# Altium project STM32H7_Expand.PrjPcb
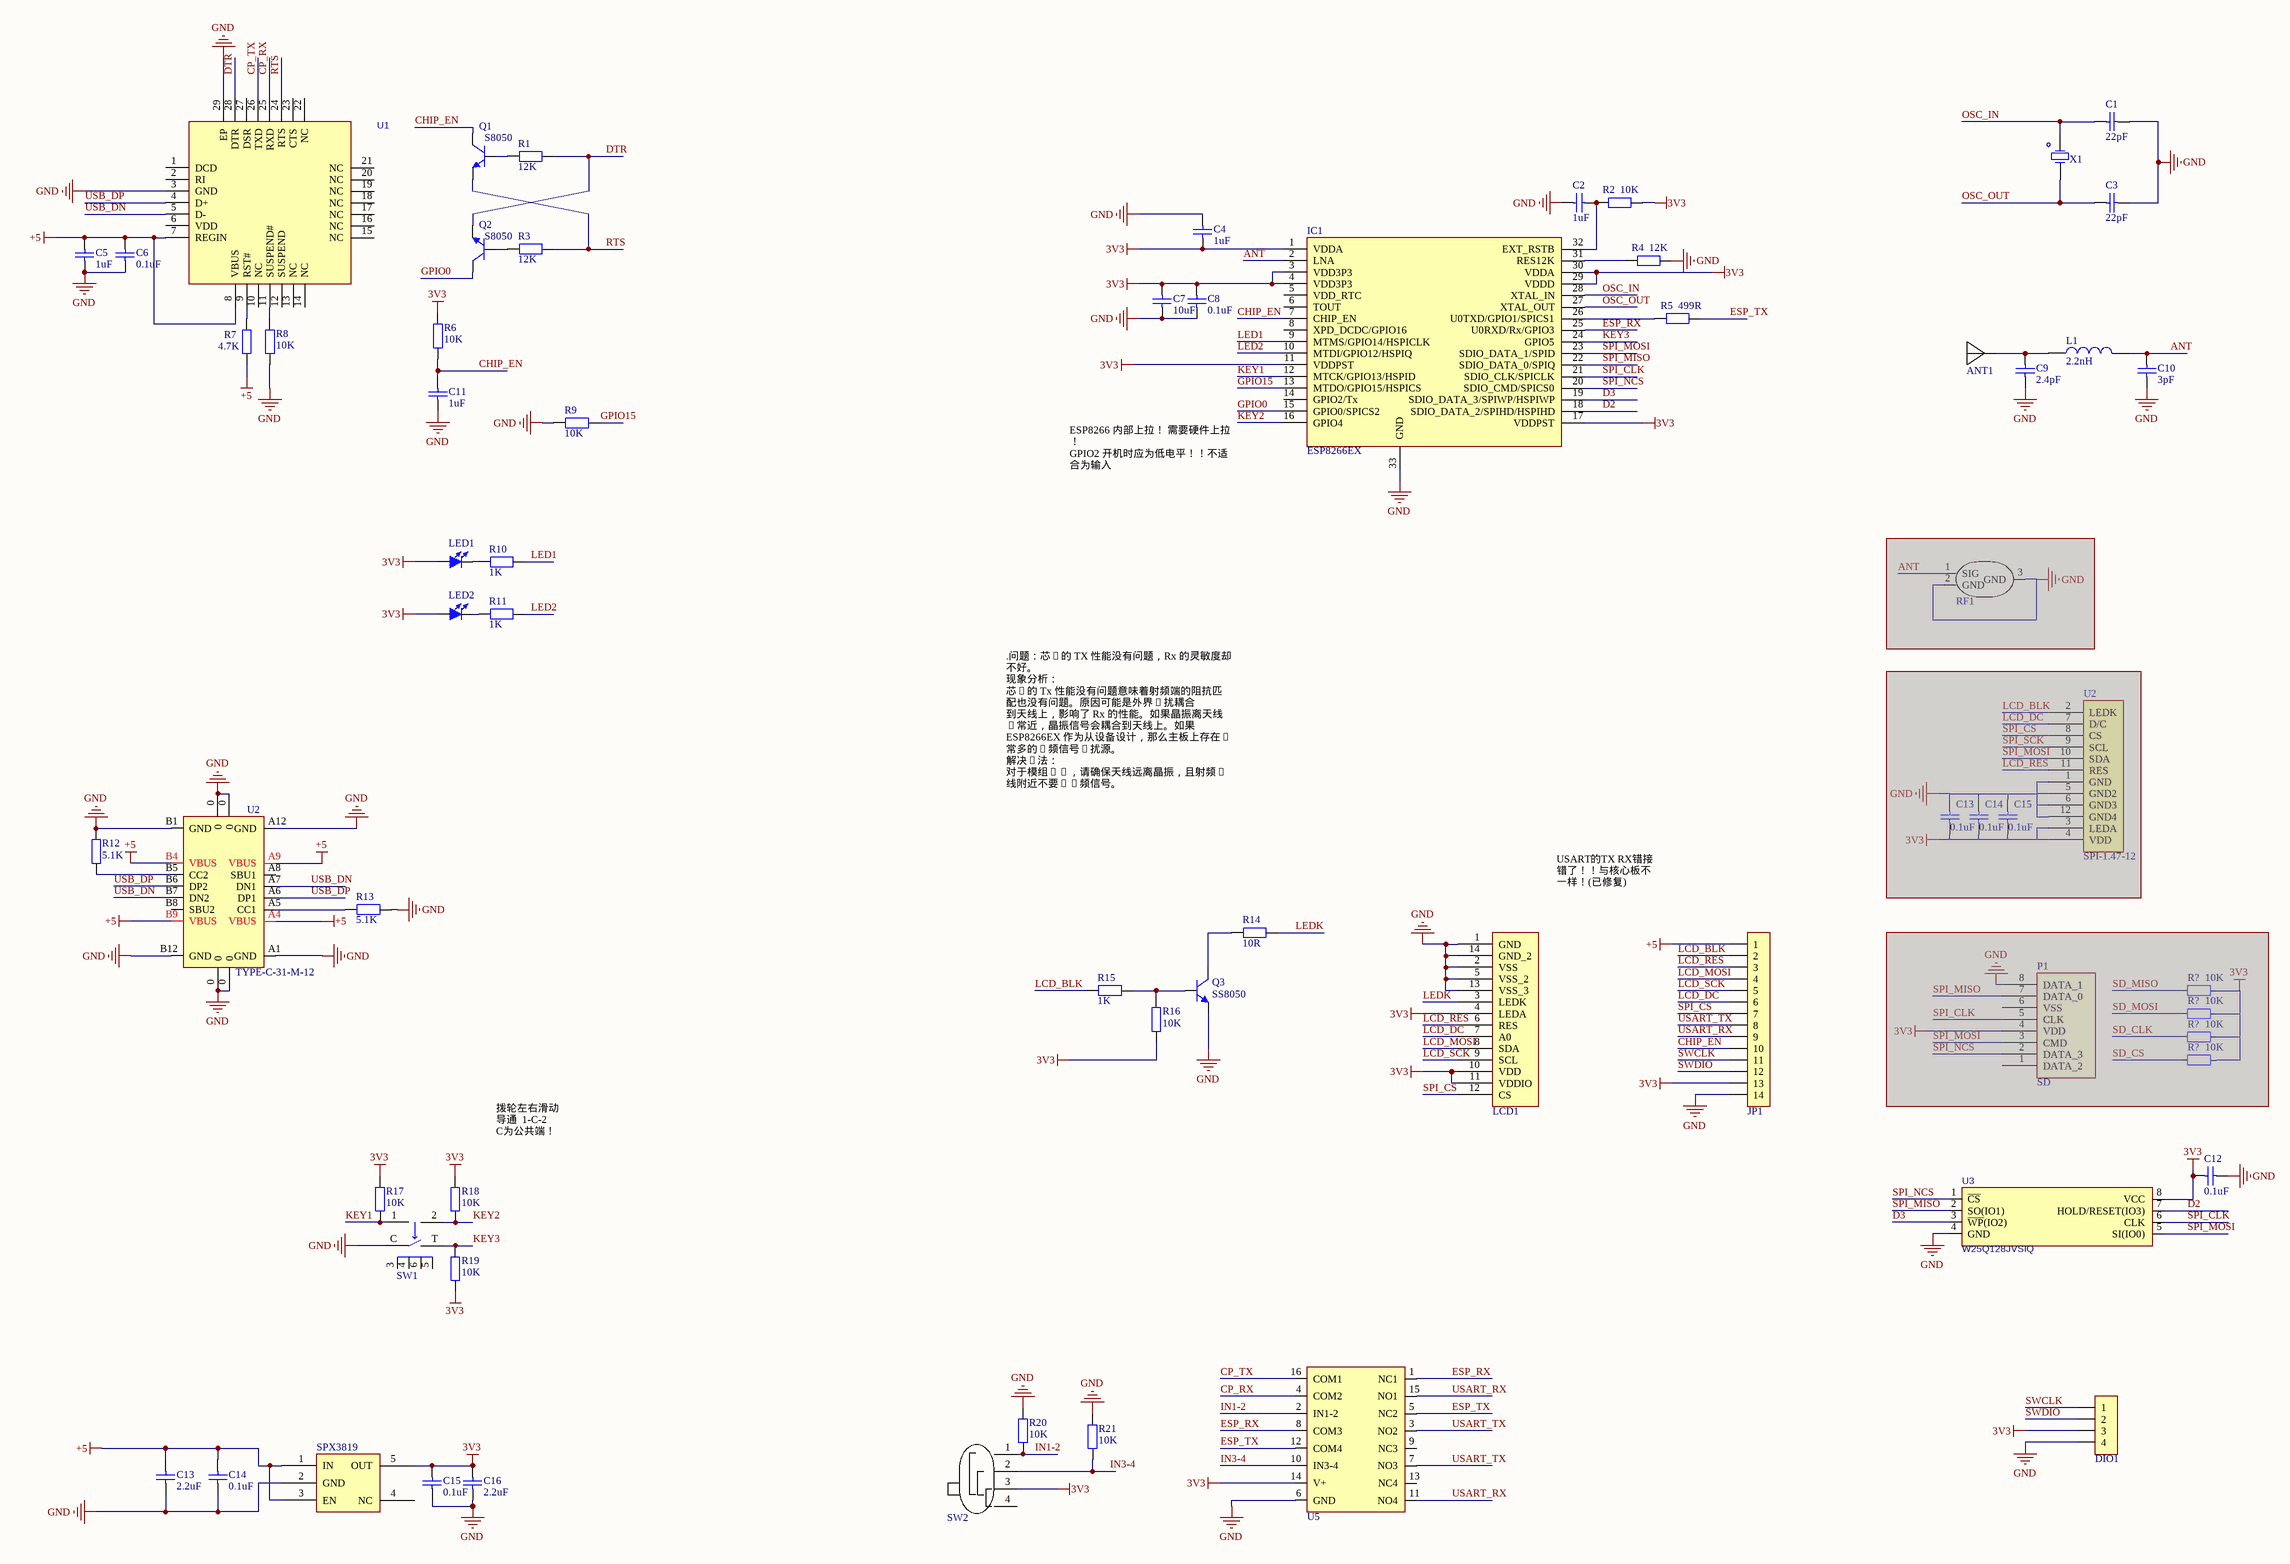
[diagram p0: STM32H7_Expand.SchDoc]
1 sheet, 66 parts. Net scope: global (net labels, ports and power ports of the same name join across sheets).
Board file: STM32H7_Expand.PcbDoc

## Sheet STM32H7_Expand.SchDoc
size A2; SheetNumber: 1; SheetTotal: 1

### Parts
(Parts that share a designator on the sheet are numbered #1, #2 ... from top to bottom, then left to right.)
ANT1  AN9520-245  [AN9520-245]  (value not drawn)
C1  22pF  [C0603_L]
C2  1uF  [C0603_L]
C3  22pF  [C0603_L]
C4  1uF  [C0603_L]
C5  1uF  [C0603_L]
C6  0.1uF  [C0603_L]
C7  10uF  [C0603_L]
C8  0.1uF  [C0603_L]
C9  2.4pF  [C0402_L]
C10  3pF  [C0402_L]
C11  1uF  [C0603_L]
C12  0.1uF  [C0603_L]
C13#1  0.1uF  [C0603_L]  (masked out: inside a compile mask, not in the netlist)
C13#2  2.2uF  [C0603_L]
C14#1  0.1uF  [C0603_L]  (masked out: inside a compile mask, not in the netlist)
C14#2  0.1uF  [C0603_L]
C15#1  0.1uF  [C0603_L]  (masked out: inside a compile mask, not in the netlist)
C15#2  0.1uF  [C0603_L]
C16  2.2uF  [C0603_L]
DIO1  HDR-1X4  [MX 1.25-WS-4P]  (value not drawn)
IC1  ESP8266EX  [QFN32 5x5_L]
JP1  FH34SRJ-14S-0.5SH(50)  [FH34SRJ-14S-0.5SH(50)]  (value not drawn)
L1  2.2nH  [L0402]
LCD1  SPI144-14  [FPC-0.8-14P]  (value not drawn)
LED1  (no value)  [LED0603_R]
LED2  (no value)  [LED0603_B]
P1  SD  [TF-01A]  (masked out: inside a compile mask, not in the netlist)
Q1  S8050  [SOT23-3N]
Q2  S8050  [SOT23-3N]
Q3  SS8050  [SOT23-3N]
R1  12K  [R0603_L]
R2  10K  [R0603_L]
R3  12K  [R0603_L]
R4  12K  [R0603_L]
R5  499R  [R0603_L]
R6  10K  [R0603_L]
R7  4.7K  [R0603_L]
R8  10K  [R0603_L]
R9  10K  [R0603_L]
R10  1K  [R0603_L]
R11  1K  [R0603_L]
R12  5.1K  [R0603_L]
R13  5.1K  [R0603_L]
R14  10R  [R0603_L]
R15  1K  [R0603_L]
R16  10K  [R0603_L]
R17  10K  [R0603_L]
R18  10K  [R0603_L]
R19  10K  [R0603_L]
R20  10K  [R0603_L]
R21  10K  [R0603_L]
R?#1  10K  [RES_0402]  (masked out: inside a compile mask, not in the netlist)
R?#2  10K  [RES_0402]  (masked out: inside a compile mask, not in the netlist)
R?#3  10K  [RES_0402]  (masked out: inside a compile mask, not in the netlist)
R?#4  10K  [RES_0402]  (masked out: inside a compile mask, not in the netlist)
RF1  BWIPX-1-001E  [IPEX-SMD_BWIPX-1-001E]  (value not drawn)  (masked out: inside a compile mask, not in the netlist)
SW1  TM-2023  [SW-SMD_TM-2023-1]  (value not drawn)
SW2  MSK13C02  [SW-SMD_MSK13C02-SZ]  (value not drawn)
U1  CP2102-GMR  [QFN28 5x5]  (value not drawn)
U2#1  SPI-1.47-12  [FPC-0.7-12P]  (masked out: inside a compile mask, not in the netlist)
U2#2  TYPE-C-31-M-12  [TYPE-C-31-M-12]
U3  W25Q128JVSIQ  [SOIC-8W]
U4  SPX3819  [SOT23-5L]
U5  RS2299XTQC16  [QFN16 3x3_L]  (value not drawn)
X1  NX1612SA-26MHZ-STD-CIS-1  [OSC-SMD_4P-L1.6-W1.2-BL]  (value not drawn)

### Nets
3V3: C4.1 C7.2 C8.2 C12.1 C15#2.2 C16.2 DIO1.3 IC1.1(VDDA) IC1.3(VDD3P3) IC1.4(VDD3P3) IC1.11(VDDPST) IC1.17(VDDPST) IC1.29(VDDD) IC1.30(VDDA) JP1.13 LCD1.4(LEDA) LCD1.10(VDD) LCD1.11(VDDIO) LED1.1(A) LED2.1(A) R2.2 R6.1 R16.1 R17.1 R18.1 R19.2 SW2.3 U3.8(VCC) U4.5(OUT) U5.14(V+)
+5: C5.2 C6.2 C13#2.2 C14#2.2 JP1.1 R7.2 U1.7(REGIN) U1.8(VBUS) U2#2.A4(VBUS) U2#2.A9(VBUS) U2#2.B4(VBUS) U2#2.B9(VBUS) U4.1(IN) U4.3(EN)
GND: C1.1 C2.2 C3.1 C4.2 C5.1 C6.1 C7.1 C8.1 C9.1 C10.1 C11.1 C12.2 C13#2.1 C14#2.1 C15#2.1 C16.1 DIO1.4 IC1.33(GND) JP1.14 LCD1.1(GND) LCD1.2(VSS) LCD1.5(VSS_2) LCD1.13(VSS_3) LCD1.14(GND_2) Q3.2(E) R4.2 R8.2 R9.1 R12.2 R13.1 R20.1 R21.1 SW1.C U1.3(GND) U1.29(EP) U2#2.0 U2#2.A1(GND) U2#2.A12(GND) U2#2.B1(GND) U2#2.B12(GND) U3.4(GND) U4.2(GND) U5.6(GND)
ANT: C10.2 IC1.2(LNA) L1.2
CHIP_EN: C11.2 IC1.7(CHIP_EN) JP1.10 Q1.3(C) R6.2
CP_RX: U1.25(RXD) U5.4(COM2)
CP_TX: U1.26(TXD) U5.16(COM1)
D2: IC1.18(SDIO_DATA_2/SPIHD/HSPIHD) U3.7(HOLD/RESET(IO3))
D3: IC1.19(SDIO_DATA_3/SPIWP/HSPIWP) U3.3(~{WP}(IO2))
DTR: Q2.2(E) R1.2 U1.28(DTR)
ESP_RX: IC1.25(U0RXD/Rx/GPIO3) U5.1(NC1) U5.8(COM3)
ESP_TX: R5.2 U5.5(NC2) U5.12(COM4)
GPIO0: IC1.15(GPIO0/SPICS2) Q2.3(C)
GPIO15: IC1.13(MTDO/GPIO15/HSPICS) R9.2
IN1-2: R20.2 SW2.1 U5.2(IN1-2)
IN3-4: R21.2 SW2.2 U5.10(IN3-4)
KEY1: IC1.12(MTCK/GPIO13/HSPID) R17.2 SW1.1
KEY2: IC1.16(GPIO4) R18.2 SW1.2
KEY3: IC1.24(GPIO5) R19.1 SW1.T
LCD_BLK: JP1.2 R15.1
LCD_DC: JP1.6 LCD1.7(A0)
LCD_MOSI: JP1.4 LCD1.8(SDA)
LCD_RES: JP1.3 LCD1.6(RES)
LCD_SCK: JP1.5 LCD1.9(SCL)
LED1: IC1.9(MTMS/GPIO14/HSPICLK) R10.2
LED2: IC1.10(MTDI/GPIO12/HSPIQ) R11.2
LEDK: LCD1.3(LEDK) R14.1
OSC_IN: C1.2 IC1.28(XTAL_IN) X1.1(IN)
OSC_OUT: C3.2 IC1.27(XTAL_OUT) X1.3(OUT)
RTS: Q1.2(E) R3.2 U1.24(RTS)
SPI_CLK: IC1.21(SDIO_CLK/SPICLK) U3.6(CLK)
SPI_CS: JP1.7 LCD1.12(CS)
SPI_MISO: IC1.22(SDIO_DATA_0/SPIQ) U3.2(SO(IO1))
SPI_MOSI: IC1.23(SDIO_DATA_1/SPID) U3.5(SI(IO0))
SPI_NCS: IC1.20(SDIO_CMD/SPICS0) U3.1(~{CS})
SWCLK: DIO1.1 JP1.11
SWDIO: DIO1.2 JP1.12
USART_RX: JP1.9 U5.11(NO4) U5.15(NO1)
USART_TX: JP1.8 U5.3(NO2) U5.7(NO3)
USB_DN: U1.5(D-) U2#2.A7(DN1) U2#2.B7(DN2)
USB_DP: U1.4(D+) U2#2.A6(DP1) U2#2.B6(DP2)
NetANT1_1: ANT1.1 C9.2 L1.1
NetC2_1: C2.1 IC1.32(EXT_RSTB) R2.1
NetIC1_26: IC1.26(U0TXD/GPIO1/SPICS1) R5.1
NetIC1_31: IC1.31(RES12K) R4.1
NetLED1_2: LED1.2(K) R10.1
NetLED2_2: LED2.2(K) R11.1
NetQ1_1: Q1.1(B) R1.1
NetQ2_1: Q2.1(B) R3.1
NetQ3_1: Q3.1(B) R15.2 R16.2
NetQ3_3: Q3.3(C) R14.2
NetR7_1: R7.1 U1.9(RST#)
NetR8_1: R8.1 U1.11(SUSPEND#)
NetR12_1: R12.1 U2#2.B5(CC2)
NetR13_2: R13.2 U2#2.A5(CC1)

Not connected (* = marked no-connect by the designer): IC1 5(VDD_RTC) 6(TOUT) 8(XPD_DCDC/GPIO16) 14(GPIO2/Tx); SW1 3 4 5 6; SW2 4; U1 1(DCD) 2(RI) 6(VDD) 10(NC) 12(SUSPEND) 13(NC) 14(NC) 15(NC) 16(NC) 17(NC) 18(NC) 19(NC) 20(NC) 21(NC) 22(NC) 23(CTS) 27(DSR); U2#2 A8(SBU1) B8(SBU2); U4 4(NC); U5 9(NC3) 13(NC4); X1 2(GND) 4(GND)

### Notes on the sheet
- ESP8266 内部上拉！ 需要硬件上拉！
  GPIO2 开机时应为低电平！！不适合为输入
- .问题：芯⽚的 TX 性能没有问题，Rx 的灵敏度却不好。
  现象分析：
  芯⽚的 Tx 性能没有问题意味着射频端的阻抗匹配也没有问题。原因可能是外界⼲扰耦合
  到天线上，影响了 Rx 的性能。如果晶振离天线⾮常近，晶振信号会耦合到天线上。如果
  ESP8266EX 作为从设备设计，那么主板上存在⾮常多的⾼频信号⼲扰源。
  解决⽅法：
  对于模组⽽⾔，请确保天线远离晶振，且射频⾛线附近不要⾛⾼频信号。
- USART的TX RX错接错了！！与核心板不一样！(已修复)
- (near R18) 拨轮左右滑动
  导通  1-C-2
  C为公共端！

### Library data of the parts
ANT1 = AN9520-245: 陶瓷天线; BOM名称: PCB板载天线; 联系卖家，免费技术支持: 唯一出售店铺网址https://shop463601444.taobao.com
C1-C12 C13#1 C13#2 C14#1 C14#2 C15#1 C15#2 C16 = C: 贴片电容; BOM名称: 无极性贴片电容; 联系卖家，免费查找封装: 唯一出售店铺网址https://shop463601444.taobao.com; 封装库来自淘宝卖家ID：黄晶宝石: 其他店铺购入均为盗版假冒封装库，请立即申请退款
DIO1 = Header 4: 4P接插件; 联系卖家，免费技术支持: 唯一出售店铺网址https://shop463601444.taobao.com; BOM名称: 4P接插件
IC1 = ESP8266EX: WIFI-芯片 / C77967
JP1 = FH34SRJ-14S-0.5SH(50): C324724
L1 = L: 贴片小功率电感; BOM名称: 小功率贴片电感; 联系卖家，免费查找封装: 唯一出售店铺网址https://shop463601444.taobao.com; 封装库来自淘宝卖家ID：黄晶宝石: 其他店铺购入均为盗版假冒封装库，请立即申请退款
LED1 LED2 = LED-SMD: 贴片LED; 封装库来自淘宝卖家 ID：黄晶宝石: 其他店铺购入均为假冒，请立即申请退款，本店奖励现金5~20元; BOM名称: 贴片LED
P1 = Micro SD_TF-01A: TF-01A / C91145; 联系卖家，免费查找封装: 唯一出售店铺网址https://shop463601444.taobao.com
Q1 Q2 = 8050-SMD: 高频放大-NPN型; 联系卖家，免费查找封装: 唯一出售店铺网址https://shop463601444.taobao.com; 封装库来自淘宝卖家 ID：黄晶宝石: 其他店铺购入均为盗版，不享受售后技术支持服务，请立即申请退款; 参数: 40V 1.5A 1W 100MHZ; BOM名称: 高频放大-NPN型
Q3 = 8050-SMD: C2150 / NPN; BOM名称: 高频放大-NPN型; 联系卖家，免费查找封装: 唯一出售店铺网址https://shop463601444.taobao.com; 封装库来自淘宝卖家 ID：黄晶宝石: 其他店铺购入均为盗版，不享受售后技术支持服务，请立即申请退款; 参数: 40V 1.5A 1W 100MHZ
R1-R21 = R: 贴片电阻; 联系卖家，免费查找封装: 唯一出售店铺网址https://shop463601444.taobao.com; 封装库来自淘宝卖家ID：黄晶宝石: 其他店铺购入均为盗版假冒封装库，请立即申请退款; BOM名称: 贴片电阻
R?#1-R?#4 = 电阻-0402: Resistor; Value: 22R
RF1 = BWIPX-1-001E: Manufacturer: BAT WIRELESS(蝙蝠无线); Add into BOM: yes; Symbol: BWIPX-1-001E; Device: BWIPX-1-001E; LCSC Part Name: RF天线座; Supplier Part: C496552; Manufacturer Part: BWIPX-1-001E; Supplier Footprint: -; JLCPCB Part Class: Extended Part; Datasheet: https://atta.szlcsc.com/upload/public/pdf/source/20201223/C496552_05E5A9956EAE1A8819C5051D085B1DED.pdf; Supplier: LCSC; Convert to PCB: yes
SW1 = TM-2023: Manufacturer: XKB Connectivity(中国星坤); Add into BOM: yes; Symbol: TM-2023; Device: TM-2023; LCSC Part Name: 3挡拨轮开关; Supplier Part: C318951; Manufacturer Part: TM-2023; Supplier Footprint: SMD; Datasheet: https://atta.szlcsc.com/upload/public/pdf/source/20211015/4E21B3A9DEF1E687333BA1DF36F89D09.pdf; Supplier: LCSC; Convert to PCB: yes; JLCPCB Part Class: Extended Part
SW2 = MSK13C02: Manufacturer: SHOU HAN(首韩); Add into BOM: yes; Current Rating (AC): 300mA; Voltage Rating (AC): 4V; Circuit: 单刀双掷; Mechanical Life: 10000; Actuator Color: 黑色; Actuator Style: 矩形柱状; Pin Style: PC引脚; Symbol: MSK13C02; Device: MSK13C02; LCSC Part Name: 三档侧拨贴片 8脚拨动 黑柄,柄长1.5mm,耐温,高品质; Supplier Part: C2681567; Manufacturer Part: MSK13C02; Supplier Footprint: SMD; JLCPCB Part Class: Extended Part; Datasheet: https://atta.szlcsc.com/upload/public/pdf/source/20210224/C2681569_FC58956A868B5CB7B9861AAED20A2183.pdf; Supplier: LCSC; Convert to PCB: yes; Current Rating (DC): -; Voltage Rating (DC): -; Mounting Style: -; Operating Temperature: -10~+50
U1 = CP2102-GMR: BOM_Manufacturer: SILICON LABS; BOM_Supplier: LCSC; BOM_Manufacturer Part: CP2102-GMR; BOM_Supplier Part: C6568; BOM_JLCPCB Part Class: Basic Part; spicePre: U; spiceSymbolName: CP2102-GMR
U2#1 = SPI-1.47-12: LCD 1.47寸屏幕 / ST7789驱动
U3 = W25Q128: SPI FLASH; 封装库来自 淘宝卖家 ID：黄晶宝石: 其他店铺购入均为盗版假冒封装库，请立即申请退款
U5 = RS2299XTQC16: 300MHz,4.5欧姆,4通道2选1复用器; Manufacturer: RUNIC(润石); Add into BOM: yes; Symbol: RS2299XTQC16; Device: RS2299XTQC16; LCSC Part Name: 模拟开关RS2299XTQC16; Supplier Part: C255484; Manufacturer Part: RS2299XTQC16; LCSC On Sale: 1; Supplier Footprint: QFN-16L; JLCPCB On Sale: 1; Datasheet: https://atta.szlcsc.com/upload/public/pdf/watermark/20190926/C255484_4C013E9A810B0A2AFDD36AE75CDB7C7A.pdf; Supplier: LCSC; Convert to PCB: yes; Switch Circuit: -; Multiplexer/Demultiplexer Circuit: -; Number of Circuits: -; On Resistance (Max): -; Switch Voltage (Max): -; On Time (Max): -; Off Time (Max): -; Supply Voltage: -; Operating Temperature: -; JLCPCB Part Class: Extended Part
X1 = NX1612SA-26MHZ-STD-CIS-1: Manufacturer: NDK; Add into BOM: yes; Symbol: NX1612SA-26MHZ-STD-CIS-1; Device: NX1612SA-26MHZ-STD-CIS-1; LCSC Part Name: 26MHz 8pF ±10ppm; Supplier Part: C280835; Manufacturer Part: NX1612SA-26MHZ-STD-CIS-1; Supplier Footprint: SMD1612-4P; JLCPCB Part Class: Extended Part; Datasheet: https://atta.szlcsc.com/upload/public/pdf/source/20190115/C280835_09B940BBA18D5775216C5CCB22C59785.pdf; Supplier: LCSC; Convert to PCB: yes; Crystal Type: -; Frequency Tolerance: -; Frequency Stability: -; Load Capacitance: -; Operating Temperature: -